# EAGLE design power_supply_breakout_module (EAGLE 6.4)
AUTHOR: Brad Campbell; REV: A; TITLE: Power Supply Module
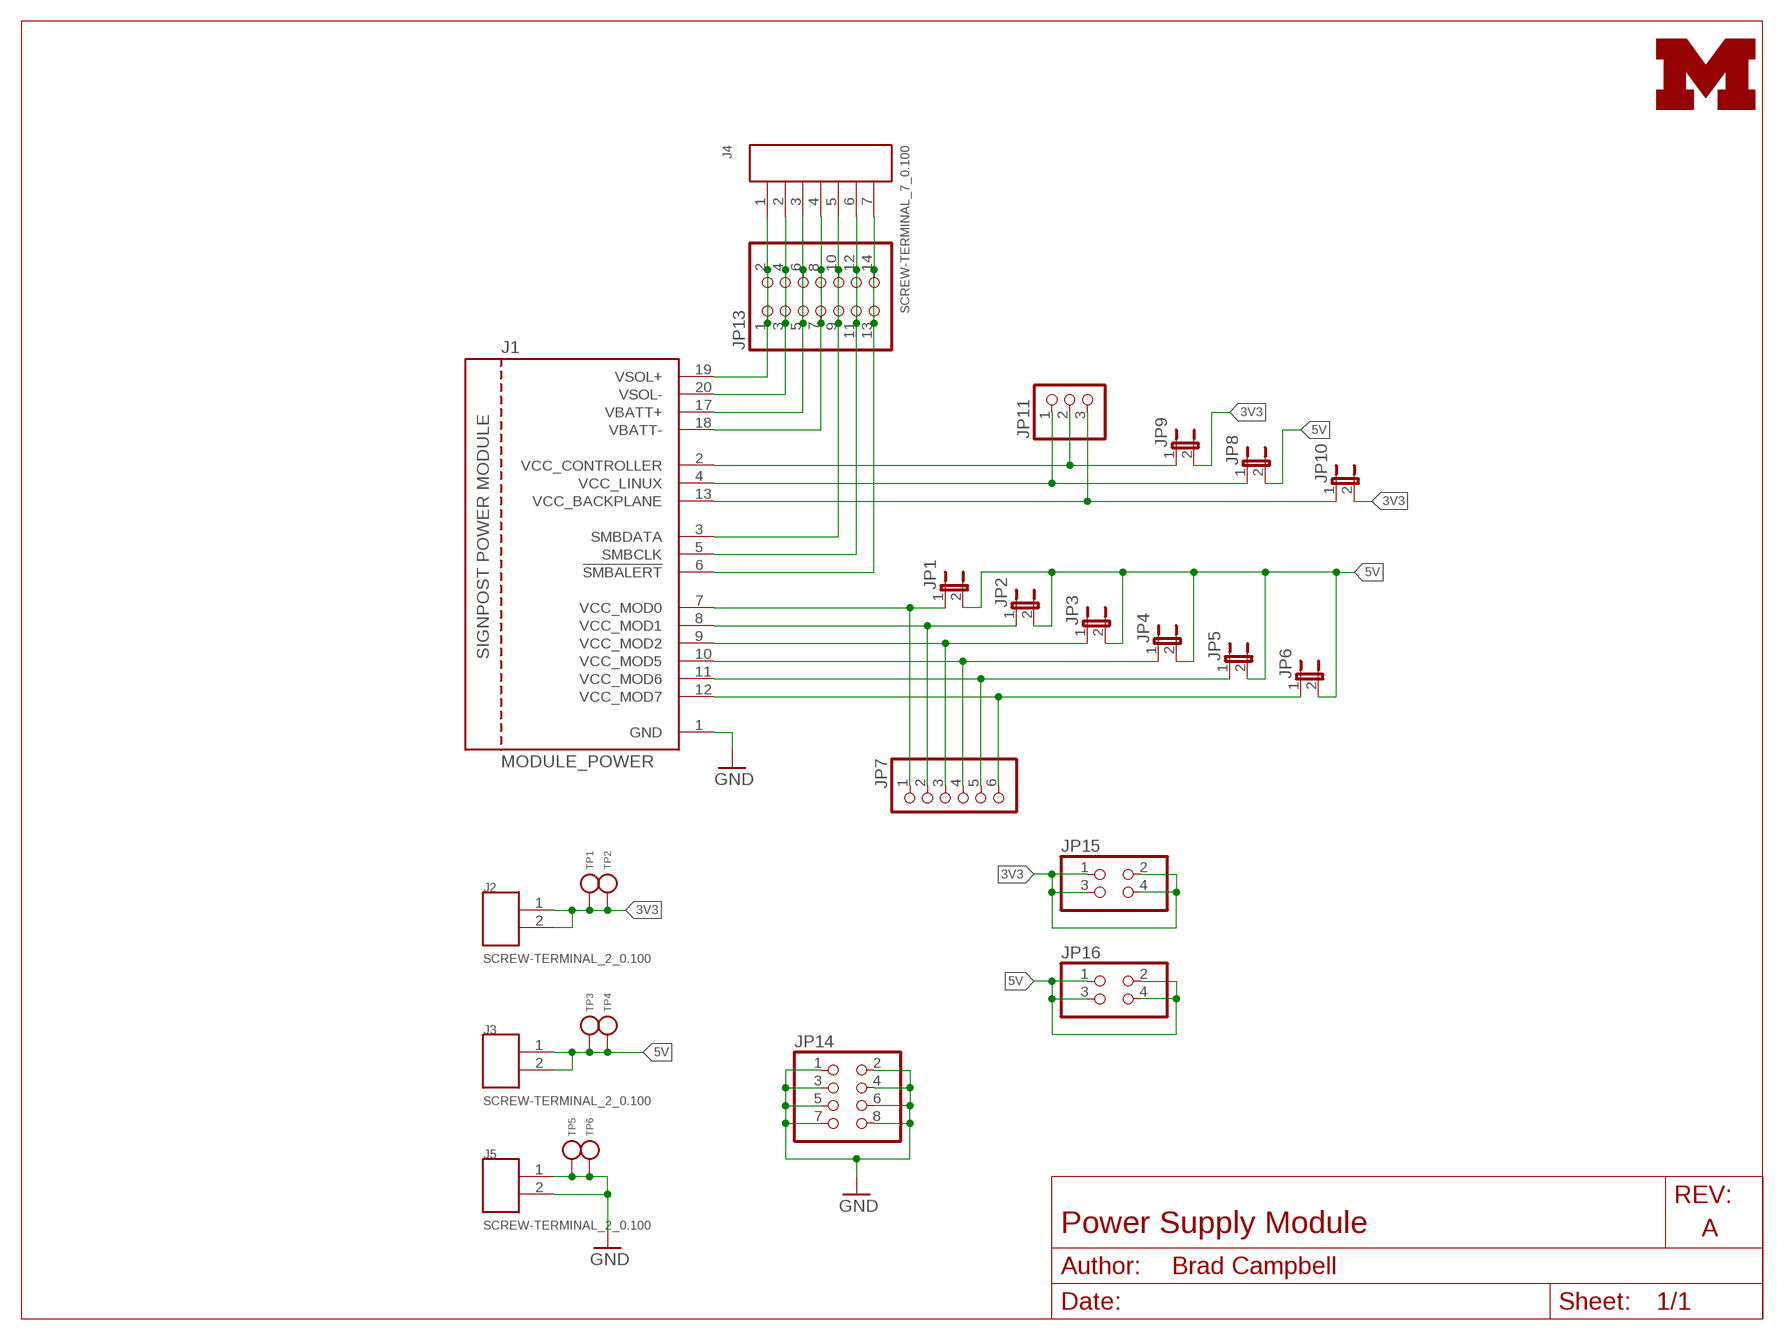
[diagram p0: schematic, sheet 1]

## Parts
J1  MODULE_POWER  [MODULE_POWER]
J2  SCREW-TERMINAL_2_0.100  [CONN_BLOCK_2]
J3  SCREW-TERMINAL_2_0.100  [CONN_BLOCK_2]
J4  SCREW-TERMINAL_7_0.100  [CONN_BLOCK_7]
J5  SCREW-TERMINAL_2_0.100  [CONN_BLOCK_2]
JP1  JUMPER-2PTH  [1X02]
JP2  JUMPER-2PTH  [1X02]
JP3  JUMPER-2PTH  [1X02]
JP4  JUMPER-2PTH  [1X02]
JP5  JUMPER-2PTH  [1X02]
JP6  JUMPER-2PTH  [1X02]
JP7  PINHD-1X6  [1X06]
JP8  JUMPER-2PTH  [1X02]
JP9  JUMPER-2PTH  [1X02]
JP10  JUMPER-2PTH  [1X02]
JP11  PINHD-1X3  [1X03]
JP13  PINHD-2X7  [2X07]
JP14  PINHD-2X4  [2X04]
JP15  PINHD-2X2  [2X02]
JP16  PINHD-2X2  [2X02]
LOGO1  UMICH_SOLID_MEDIUM  [UMICH_SOLID_200MIL]
TP1  TEST_POINT_0.040IN  [TESTPOINT_0.040IN]
TP2  TEST_POINT_0.040IN  [TESTPOINT_0.040IN]
TP3  TEST_POINT_0.040IN  [TESTPOINT_0.040IN]
TP4  TEST_POINT_0.040IN  [TESTPOINT_0.040IN]
TP5  TEST_POINT_0.040IN  [TESTPOINT_0.040IN]
TP6  TEST_POINT_0.040IN  [TESTPOINT_0.040IN]

## Nets
3V3: J2.1 J2.2 JP9.2 JP10.2 JP15.1 JP15.2 JP15.3 JP15.4 TP1.TESTPOINT TP2.TESTPOINT
5V: J3.1 J3.2 JP1.2 JP2.2 JP3.2 JP4.2 JP5.2 JP6.2 JP8.2 JP16.1 JP16.2 JP16.3 JP16.4 TP3.TESTPOINT TP4.TESTPOINT
!SMBALERT: J1.6(!SMBALERT) J4.7 JP13.13 JP13.14
GND: J1.1(GND) J5.1 J5.2 JP14.1 JP14.2 JP14.3 JP14.4 JP14.5 JP14.6 JP14.7 JP14.8 TP5.TESTPOINT TP6.TESTPOINT
SMBCLK: J1.5(SMBCLK) J4.6 JP13.11 JP13.12
SMBDATA: J1.3(SMBDATA) J4.5 JP13.9 JP13.10
VBATT+: J1.17(VBATT+) J4.3 JP13.5 JP13.6
VBATT-: J1.18(VBATT-) J4.4 JP13.7 JP13.8
VCC_BACKPLANE: J1.13(VCC_BACKPLANE) JP10.1 JP11.3
VCC_CONTROLLER: J1.2(VCC_CONTROLLER) JP9.1 JP11.2
VCC_LINUX: J1.4(VCC_LINUX) JP8.1 JP11.1
VCC_MOD0: J1.7(VCC_MOD0) JP1.1 JP7.1
VCC_MOD1: J1.8(VCC_MOD1) JP2.1 JP7.2
VCC_MOD2: J1.9(VCC_MOD2) JP3.1 JP7.3
VCC_MOD5: J1.10(VCC_MOD5) JP4.1 JP7.4
VCC_MOD6: J1.11(VCC_MOD6) JP5.1 JP7.5
VCC_MOD7: J1.12(VCC_MOD7) JP6.1 JP7.6
VSOL+: J1.19(VSOL+) J4.1 JP13.1 JP13.2
VSOL-: J1.20(VSOL-) J4.2 JP13.3 JP13.4

## Library data of the parts
J1 = signpost:MODULE_POWER: Header for power module for signpost; DIGIKEY: S9172-ND
J2 J3 J5 = headers:SCREW-TERMINAL_2_0.100: 2x 0.100 in screw terminal block; DIGIKEY: 277-1273-ND; MOUSER: 651-1725656; NEWARK: 71C4107
J4 = headers:SCREW-TERMINAL_7_0.100: 7x 0.100 in screw terminal block; DIGIKEY: 277-1278-ND; MOUSER: 651-1725708; NEWARK: 14X4980
JP1-JP6 JP8-JP10 = SparkFun-Passives:JUMPER-2: Jumper Basic 0.1" spaced jumper. Use with breakaway headers.
JP7 = pinhead:PINHD-1X6: PIN HEADER
JP11 = pinhead:PINHD-1X3: PIN HEADER
JP13 = pinhead:PINHD-2X7: PIN HEADER
JP14 = pinhead:PINHD-2X4: PIN HEADER
JP15 JP16 = pinhead:PINHD-2X2: PIN HEADER
LOGO1 = logos:UMICH_SOLID
TP1-TP6 = headers:TEST_POINT_0.040IN: 0.040in Test Point; DIGIKEY: 5001K-ND

## Board
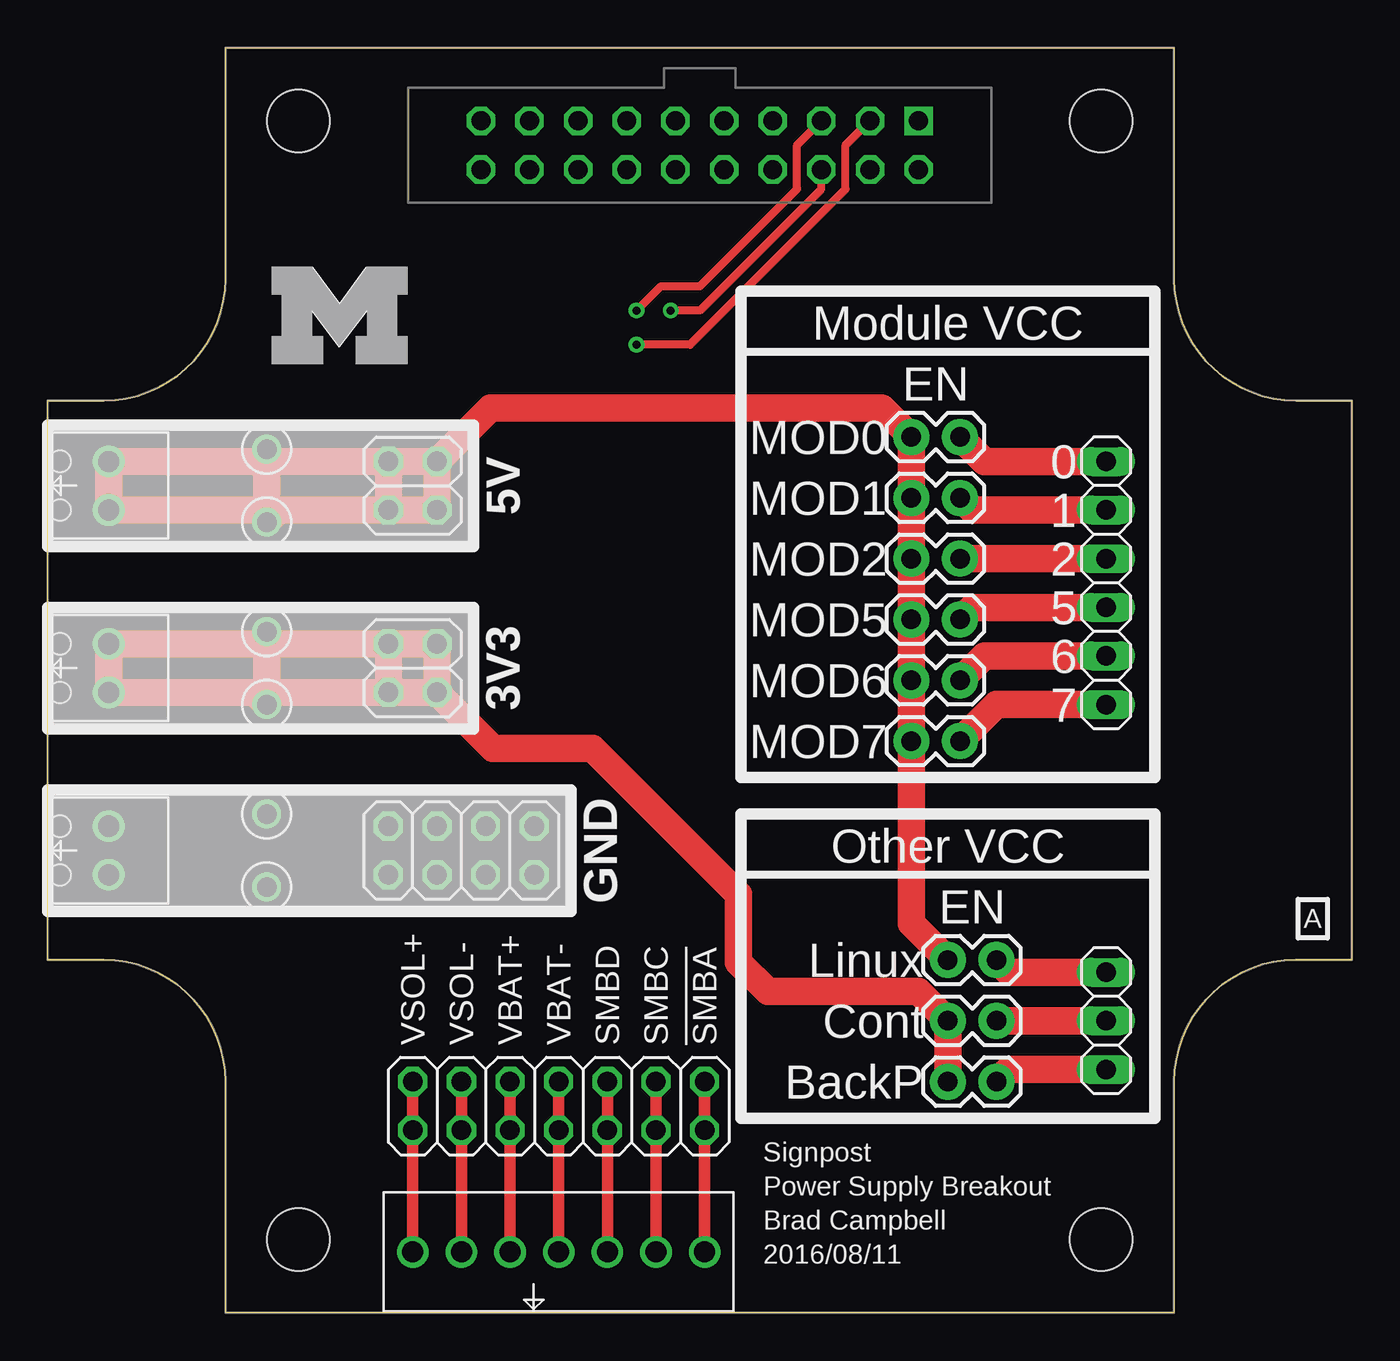
[diagram p1: board, top side]
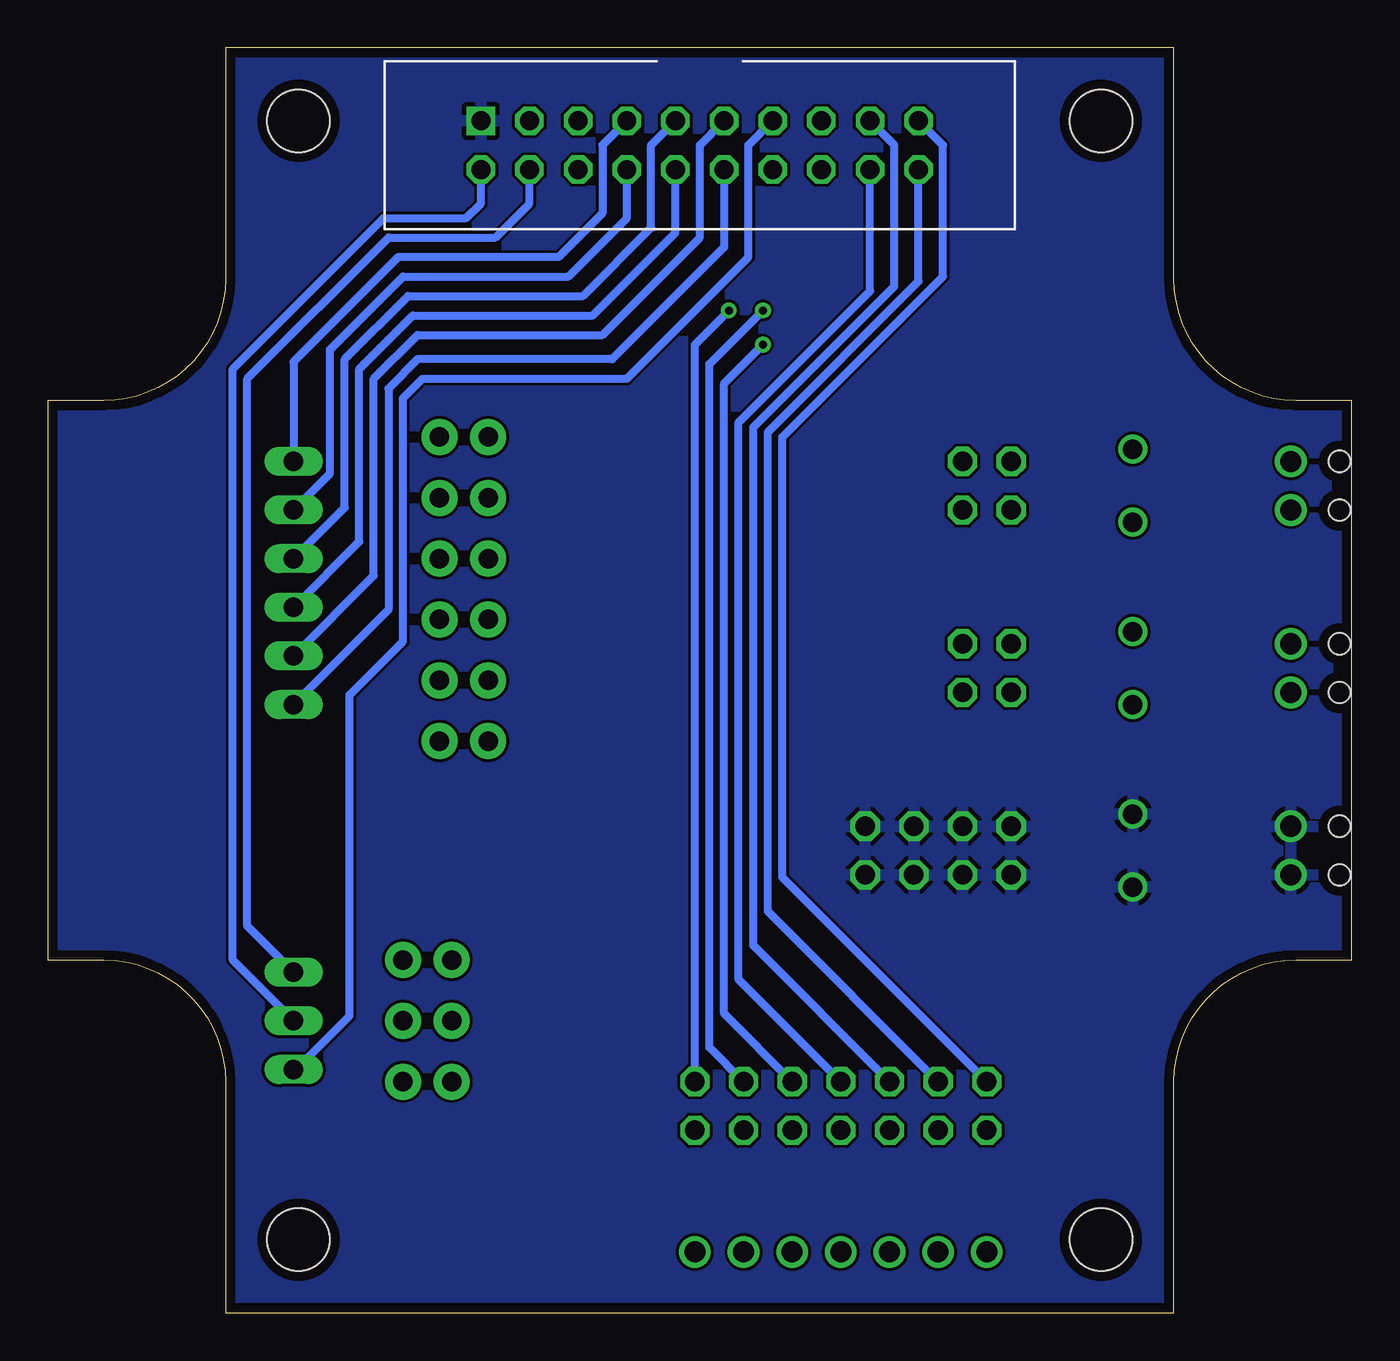
[diagram p2: board, bottom side, seen from below]

Size 68.07 x 66.04 mm. Coordinates in mm from the lower left corner, seen from the top.
Outline: 9.27,0 9.27,12.06 arc90 2.92,18.41 0,18.41 0,47.62 2.92,47.62 arc90 9.27,53.98 9.27,66.04 58.8,66.04 58.8,53.98 arc90 65.15,47.62 68.07,47.62 68.07,18.41 65.15,18.41 arc90 58.8,12.06 58.8,0 9.27,0
Copper layers (1*16): Top 0.0178mm / dielectric 59mil / Bottom 0.0178mm
Design rules "sunstone-2lyr_v1.0.0.3": minimum track width 6mil, minimum drill 14mil, track to track 6mil, track to pad 6mil, pad to pad 6mil, via to via 6mil, smd to smd 6mil, copper to edge 20mil, drill to drill 16mil, minimum pad ring 8mil, minimum via ring 8mil, stop-mask expansion 3mil, vias tented up to drill 50mil, thermal gap 10mil
Holes 3.26 mm at 13.08,62.23 54.99,62.23 13.08,3.81 54.99,3.81

### Footprints (pad centres in the part's own frame; a part is rotated, then mirrored left to right if it is on the bottom)
MODULE_POWER = drill 0.991 square: 1 11.43,29.21 | drill 0.991 octagon: 2 11.43,26.67; 3 8.89,29.21; 4 8.89,26.67; 5 6.35,29.21; 6 6.35,26.67; 7 3.81,29.21; 8 3.81,26.67; 9 1.27,29.21; 10 1.27,26.67; 11 -1.27,29.21; 12 -1.27,26.67; 13 -3.81,29.21; 14 -3.81,26.67; 15 -6.35,29.21; 16 -6.35,26.67; 17 -8.89,29.21; 18 -8.89,26.67; 19 -11.43,29.21; 20 -11.43,26.67
CONN_BLOCK_2 = drill 1.1: 1 -1.27,0; 2 1.27,0 | hole 1.12: -1.27,-2.54; 1.27,-2.54
CONN_BLOCK_7 = drill 1.1: 1 -7.62,0; 2 -5.08,0; 3 -2.54,0; 4 0,0; 5 2.54,0; 6 5.08,0; 7 7.62,0
1X02 = drill 1.016 pad 1.88: 1 0,0; 2 2.54,0
1X06 = drill 1.016 long: 1 -6.35,0; 2 -3.81,0; 3 -1.27,0; 4 1.27,0; 5 3.81,0; 6 6.35,0
1X03 = drill 1.016 long: 1 -2.54,0; 2 0,0; 3 2.54,0
2X07 = drill 1.016 octagon: 1 -7.62,-1.27; 2 -7.62,1.27; 3 -5.08,-1.27; 4 -5.08,1.27; 5 -2.54,-1.27; 6 -2.54,1.27; 7 0,-1.27; 8 0,1.27; 9 2.54,-1.27; 10 2.54,1.27; 11 5.08,-1.27; 12 5.08,1.27; 13 7.62,-1.27; 14 7.62,1.27
2X04 = drill 1.016 octagon: 1 -3.81,-1.27; 2 -3.81,1.27; 3 -1.27,-1.27; 4 -1.27,1.27; 5 1.27,-1.27; 6 1.27,1.27; 7 3.81,-1.27; 8 3.81,1.27
2X02 = drill 1.016 octagon: 1 -1.27,-1.27; 2 -1.27,1.27; 3 1.27,-1.27; 4 1.27,1.27
TESTPOINT_0.040IN = drill 1.016: TESTPOINT 0,0

### Placement (x,y rotation side)
J1  34.04,33.02 0 top
J2  3.17,33.66 270 top
J3  3.17,43.18 270 top
J4  26.67,3.17 0 top
J5  3.17,24.13 270 top
JP1  47.62,45.72 180 top
JP2  47.62,42.55 180 top
JP3  47.62,39.37 180 top
JP4  47.62,36.2 180 top
JP5  47.62,33.02 180 top
JP6  47.62,29.84 180 top
JP7  55.24,38.1 270 top
JP8  49.53,18.41 180 top
JP9  49.53,15.24 180 top
JP10  49.53,12.06 180 top
JP11  55.24,15.24 270 top
JP13  26.67,10.79 0 top
JP14  21.59,24.13 180 top
JP15  19.05,33.66 90 top
JP16  19.05,43.18 90 top
LOGO1  11.68,49.53 0 top
TP1  11.43,35.56 0 top
TP2  11.43,31.75 0 top
TP3  11.43,41.27 0 top
TP4  11.43,45.09 0 top
TP5  11.43,26.04 0 top
TP6  11.43,22.23 0 top

### Tracks (layer width: path | path; a pad name or v marks a point on that pad's centre or on a via)
3V3
  Top 0.61: 10.79,34.92 TP1.TESTPOINT 12.06,34.92 | TP2.TESTPOINT 12.06,32.38
  Top 1.422: 10.79,34.92 J2.1 J2.2 10.79,32.38 TP2.TESTPOINT TP1.TESTPOINT | 12.06,32.38 JP15.2 | JP15.2 JP15.1 | JP15.1 JP15.3 JP15.4 | JP15.4 JP15.2 | 12.06,34.92 JP15.4 | JP10.2 JP9.2 45.47,16.76 37.59,16.76 36.07,18.29 36.07,21.84 28.45,29.46 23.24,29.46 JP15.1
5V
  Top 0.61: 10.79,44.45 TP4.TESTPOINT 12.06,44.45 | 10.79,41.91 TP3.TESTPOINT
  Top 1.422: 10.79,44.45 J3.1 J3.2 10.79,41.91 | JP16.4 JP16.3 | TP4.TESTPOINT TP3.TESTPOINT 12.06,41.91 JP16.2 | JP16.2 JP16.4 | JP16.3 JP16.1 JP16.2 | 12.06,44.45 JP16.4 | JP8.2 45.09,20.32 JP6.2 JP5.2 JP4.2 JP3.2 JP2.2 JP1.2 43.56,47.24 23.11,47.24 JP16.3
!SMBALERT  (via drill 0.41)
  Top 0.406: J1.6 40.39,58.67 34.04,52.32 v32.51,52.32
  Top 0.61: J4.7 JP13.13 JP13.14
  Bottom 0.406: JP13.14 34.29,50.55 v32.51,52.32
GND
  pour Bottom: -1.02,70.87 71.37,70.87 71.37,-5.33 -1.02,-5.33
SMBCLK  (via drill 0.41)
  Top 0.406: J1.5 39.12,60.96 39.12,58.67 34.04,53.59 32,53.59 v30.73,52.32
  Top 0.61: J4.6 JP13.11 JP13.12
  Bottom 0.406: JP13.12 33.53,13.84 33.53,49.53 v30.73,52.32
SMBDATA  (via drill 0.41)
  Top 0.406: J1.3 41.66,60.96 41.66,58.67 33.53,50.55 v30.73,50.55
  Top 0.61: J4.5 JP13.9 JP13.10
  Bottom 0.406: JP13.10 32.77,15.62 32.77,48.51 v30.73,50.55
VBATT+
  Top 0.61: J4.3 JP13.5 JP13.6
  Bottom 0.406: JP13.6 31.24,19.18 31.24,46.23 23.88,53.59 23.88,60.96 J1.17
VBATT-
  Top 0.61: J4.4 JP13.7 JP13.8
  Bottom 0.406: JP13.8 32,17.4 32,46.48 25.15,53.34 J1.18
VCC_BACKPLANE  (via drill 0.6)
  Top 0.61: JP11.3 v55.12,12.7
  Top 1.422: v55.12,12.7 50.16,12.7 JP10.1
  Bottom 0.406: v55.12,12.7 52.32,15.49 52.32,32.26 49.53,35.05 49.53,47.75 48.51,48.77 37.85,48.77 31.5,55.12 31.5,60.96 J1.13
VCC_CONTROLLER
  Top 1.422: JP11.2 JP9.1
  Bottom 0.406: JP11.2 58.42,18.41 58.42,49.28 50.55,57.15 46.23,57.15 45.47,57.91 J1.2
VCC_LINUX
  Top 1.422: JP11.1 50.16,17.78 JP8.1
  Bottom 0.406: JP11.1 57.66,20.19 57.66,48.77 50.29,56.13 44.7,56.13 42.93,57.91 J1.4
VCC_MOD0
  Top 1.422: JP7.1 48.9,44.45 JP1.1
  Bottom 0.406: J1.7 39.12,60.96 39.12,57.4 41.4,55.12 49.78,55.12 55.24,49.66 JP7.1
VCC_MOD1
  Top 1.422: JP7.2 48.26,41.91 JP2.1
  Bottom 0.406: J1.8 37.85,57.15 40.89,54.1 49.53,54.1 53.34,50.29 53.34,43.81 JP7.2
VCC_MOD2
  Top 1.422: JP7.3 JP3.1
  Bottom 0.406: J1.9 36.58,60.96 36.58,56.64 40.13,53.09 49.28,53.09 52.58,49.78 52.58,42.04 JP7.3
VCC_MOD5
  Top 1.422: JP7.4 48.26,36.83 JP4.1
  Bottom 0.406: J1.10 35.31,56.39 39.62,52.07 49.02,52.07 51.82,49.28 51.82,40.26 JP7.4
VCC_MOD6
  Top 1.422: JP7.5 48.9,34.29 JP5.1
  Bottom 0.406: JP7.5 51.05,38.48 51.05,48.77 48.77,51.05 39.12,51.05 34.04,56.13 34.04,60.96 J1.11
VCC_MOD7
  Top 1.422: JP7.6 49.53,31.75 JP6.1
  Bottom 0.406: J1.12 32.77,55.63 38.61,49.78 48.77,49.78 50.29,48.26 50.29,36.7 JP7.6
VSOL+
  Top 0.61: J4.1 JP13.1 JP13.2
  Bottom 0.406: JP13.2 29.72,22.73 29.72,45.72 21.34,54.1 21.34,60.96 J1.19
VSOL-
  Top 0.61: J4.2 JP13.3 JP13.4
  Bottom 0.406: JP13.4 30.48,20.95 30.48,45.97 22.61,53.85 J1.20

### Text on the board
tPlace: Module VCC | EN | MOD0 | 0 | 5V | MOD1 | 1 | MOD2 | 2 | 5 | MOD5 | 3V3 | 6 | MOD6 | 7 | MOD7 | GND | Other VCC | A | EN | Linux | Cont | VSOL+ | VSOL- | VBAT+ | VBAT- | SMBD | SMBC | !SMBA | BackP | Signpost | Power Supply Breakout | Brad Campbell | 2016/08/11